# EAGLE design KSM_ICSP (EAGLE 6.4)
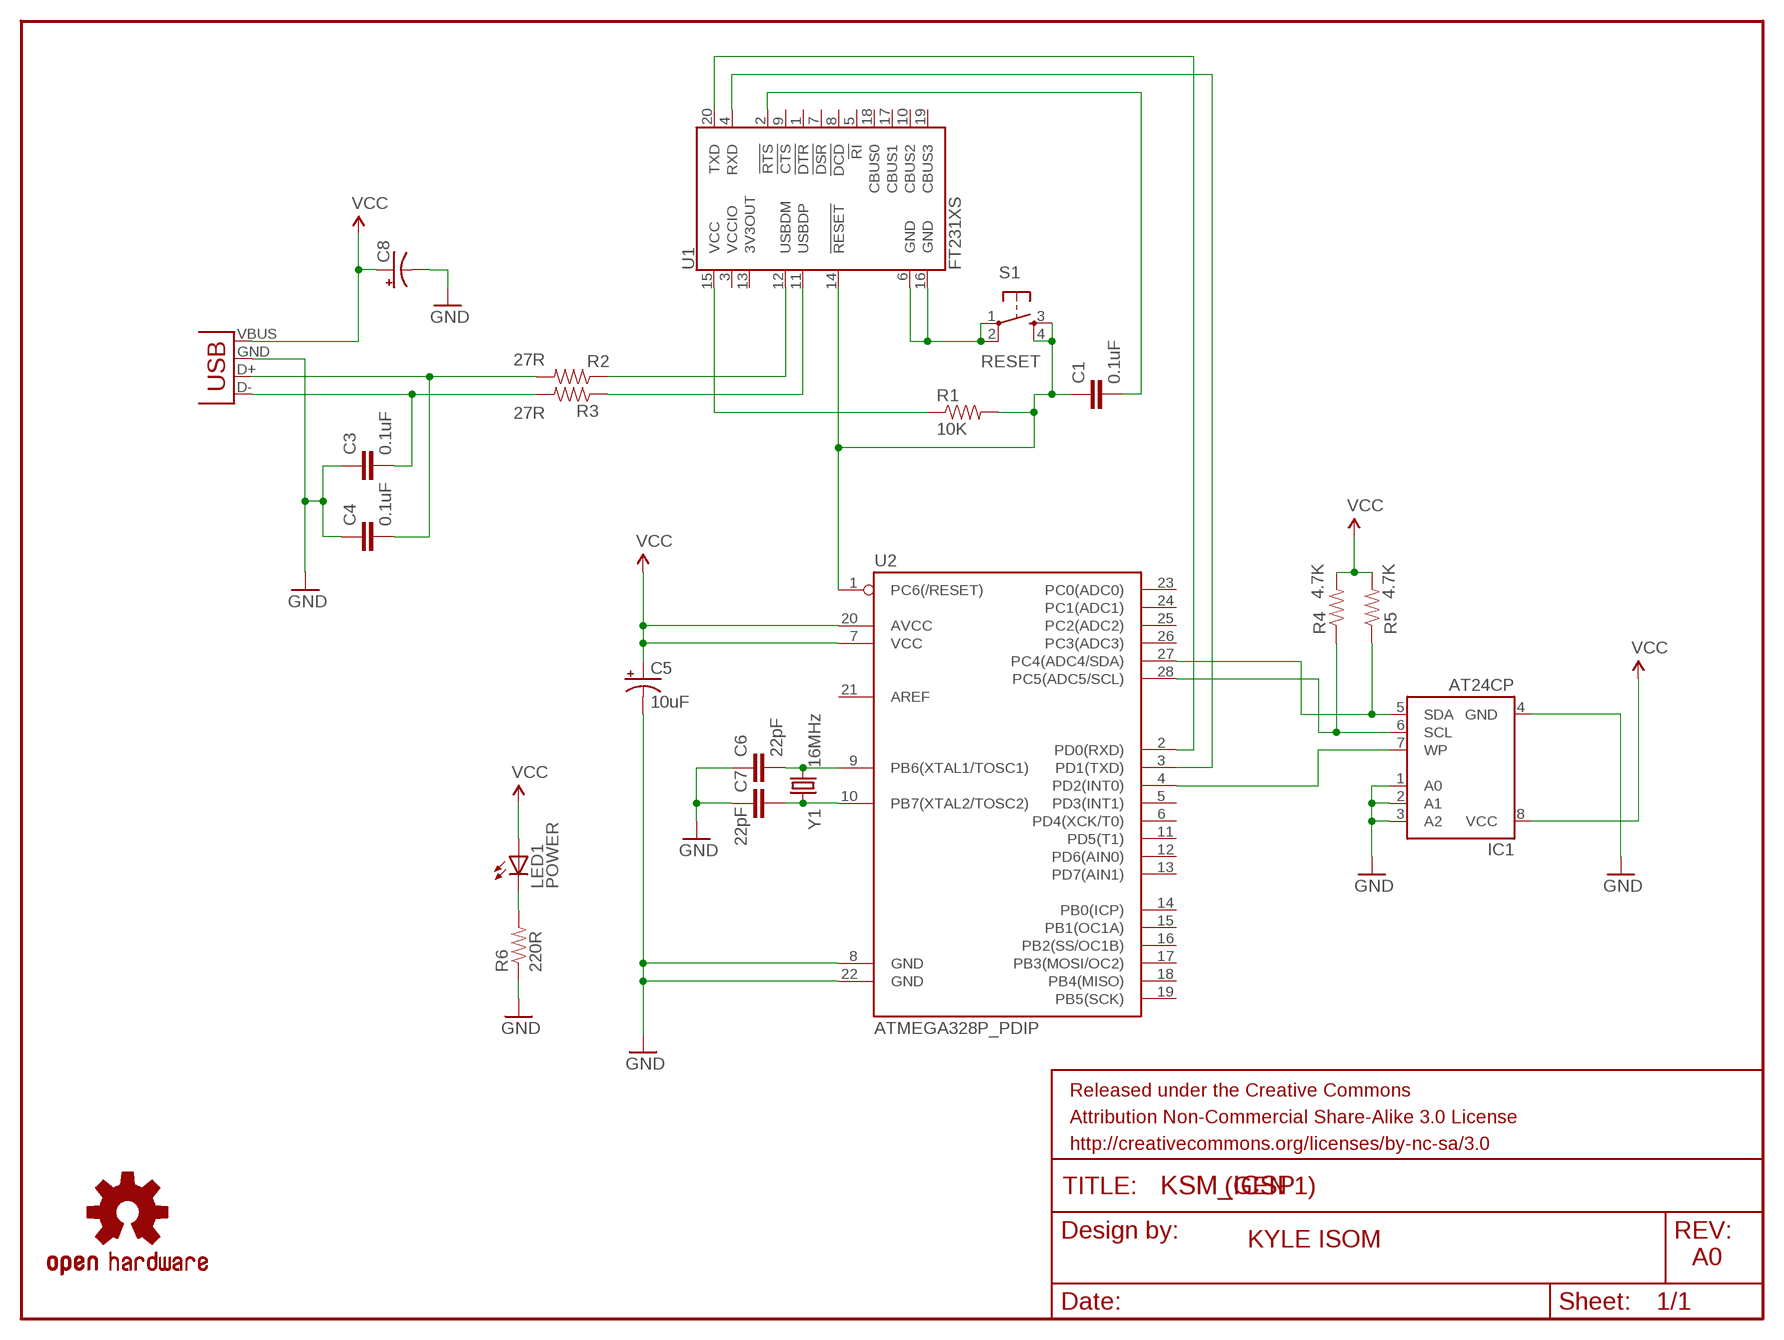
[diagram p0: schematic, sheet 1]

## Parts
C1  0.1uF  CAPPTH  [CAP-PTH-SMALL]
C3  0.1uF  CAPPTH  [CAP-PTH-SMALL]
C4  0.1uF  CAPPTH  [CAP-PTH-SMALL]
C5  10uF  CAP_POLPTH2  [CPOL-RADIAL-10UF-25V]
C6  22pF  CAPPTH  [CAP-PTH-SMALL]
C7  22pF  CAPPTH  [CAP-PTH-SMALL]
C8  CAP_POLPTH2  [CPOL-RADIAL-10UF-25V]
FRAME1  FRAME-LETTER  [CREATIVE_COMMONS]
IC1  AT24CP  [DIL08]
JP1  USB-A-H  [USB-A-H]
LED1  POWER  LED3MM  [LED3MM]
LOGO1  OSHW-LOGOL  [OSHW-LOGO-L]
R1  10K  RESISTORPTH-1/4W  [AXIAL-0.4]
R2  27R  RESISTORPTH-1/4W  [AXIAL-0.4]
R3  27R  RESISTORPTH-1/4W  [AXIAL-0.4]
R4  4.7K  RESISTORPTH-1/4W  [AXIAL-0.4]
R5  4.7K  RESISTORPTH-1/4W  [AXIAL-0.4]
R6  220R  RESISTORPTH-1/4W  [AXIAL-0.4]
S1  RESET  TAC_SWITCHPTH  [TACTILE-PTH]
U1  FT231XS  [SSOP20_L]
U2  ATMEGA328P_PDIP  [DIL28-3]
Y1  16MHz  CRYSTALHC49US  [HC49US]

## Nets
GND: C3.1 C4.1 C5.2(-) C6.1 C7.1 C8.2(-) IC1.1(A0) IC1.2(A1) IC1.3(A2) IC1.4(GND) JP1.GND(VBUS) R6.P$1 U2.8(GND) U2.22(GND)
N$1: C6.2 U2.9(PB6(XTAL1/TOSC1)) Y1.2
N$2: C7.2 U2.10(PB7(XTAL2/TOSC2)) Y1.1
N$3: IC1.7(WP) U2.4(PD2(INT0))
N$4: IC1.6(SCL) R4.P$1 U2.28(PC5(ADC5/SCL))
N$5: IC1.5(SDA) R5.P$1 U2.27(PC4(ADC4/SDA))
N$6: R3.P$1 U1.11(USBDP)
N$7: R2.P$1 U1.12(USBDM)
N$8: C4.2 JP1.D+(D-) R2.P$2
N$9: C3.2 JP1.D-(D+) R3.P$2
N$10: S1.1 S1.2 U1.6(GND) U1.16(GND)
N$11: C1.1 R1.P$2 S1.3 S1.4 U1.14(!RESET) U2.1(PC6(/RESET))
N$12: C1.2 U1.2(!RTS)
N$13: R1.P$1 U1.15(VCC)
N$14: LED1.K(C) R6.P$2
N$15: U1.20(TXD) U2.2(PD0(RXD))
N$16: U1.4(RXD) U2.3(PD1(TXD))
VCC: C5.1(+) C8.1(+) IC1.8(VCC) JP1.VBUS(GND) LED1.A R4.P$2 R5.P$2 U2.7(VCC) U2.20(AVCC)
Unconnected: U1.1(!DTR) U1.3(VCCIO) U1.5(!RI) U1.7(!DSR) U1.8(!DCD) U1.9(!CTS) U1.10(CBUS2) U1.13(3V3OUT) U1.17(CBUS1) U1.18(CBUS0) U1.19(CBUS3) U2.5(PD3(INT1)) U2.6(PD4(XCK/T0)) U2.11(PD5(T1)) U2.12(PD6(AIN0)) U2.13(PD7(AIN1)) U2.14(PB0(ICP)) U2.15(PB1(OC1A)) U2.16(PB2(SS/OC1B)) U2.17(PB3(MOSI/OC2)) U2.18(PB4(MISO)) U2.19(PB5(SCK)) U2.21(AREF) U2.23(PC0(ADC0)) U2.24(PC1(ADC1)) U2.25(PC2(ADC2)) U2.26(PC3(ADC3))

## Notes on the sheet
- (GEN 1)
- KYLE ISOM
- A0

## Library data of the parts
C1 C3 C4 C6 C7 = SparkFun-Capacitors:CAP: Capacitor Standard 0603 ceramic capacitor, and 0.1" leaded capacitor.
C5 C8 = SparkFun-Capacitors:CAP_POL: Capacitor Polarized These are standard SMD and PTH capacitors. Normally 10uF, 47uF, and 100uF in electrolytic and tantalum varieties. Always verify the external diameter of the through hole cap, it varies with capacity, voltage, and manufacturer. The EIA devices should be standard.
FRAME1 = Aesthetics:FRAME-LETTER: Schematic Frame Standard 8.5x11 US Letter frame
IC1 = EEPROM:AT24C*: 2-wire serial EEPROM; MPN: AT24C1024BW-SH-B; OC_FARNELL: 1362646; OC_NEWARK: 03P2044
JP1 = SparkFun-Connectors:USB: USB Connectors USB-B-PTH is fully proven SKU : PRT-00139/CONN-08278 USB-miniB is fully proven SKU : PRT-00587 USB-A-PCB is untested. USB-A-H is throughly reviewed, but untested. Spark Fun Electronics SKU : PRT-00437 USB-B-SMT is throughly reviewed, but untested. Needs silkscreen touching up. USB-A-S has not been used/tested USB-MB-H has not been used/tested USB-MICROB has been used. CONN-09505
LED1 = SparkFun-LED:LED: LEDs Standard schematic elements and footprints for 5mm, 3mm, 1206, and 0603 sized LEDs. 5mm - Spark Fun Electronics SKU : COM-00529 (and others)
LOGO1 = SparkFun-Aesthetics:OSHW-LOGO: Open Source Hardware Logo This logo indicates the piece of hardware it is found on incorporates a OSHW license and/or adheres to the definition of open source hardware found here: http://freedomdefined.org/OSHW
R1-R6 = SparkFun-Passives:RESISTOR: Resistor Basic schematic elements and footprints for 0603, 1206, and PTH resistors.
S1 = SparkFun-Electromechanical:TAC_SWITCH: Momentary Switch Button commonly used for reset or general input. Spark Fun Electronics SKU : COM-00097 SMT- SWCH-08247
U1 = SparkFun-DigitalIC:FT231X: FTDI FT231X Full Speed USB to Full-handshake UART This USB2.0 Full Speed IC offers a compact bridge to full handshake UART interfaces. The device is a UART, capable of operating up to 3MBaud, with low power consumption (8mA). The FT231X includes the complete FT-X series feature set and enables USB to be added into a system design quickly and easily over a UART interface.
U2 = SparkFun-DigitalIC:ATMEGA328P_PDIP: uC used in the Arduino 32kb flash, 1k EEPROM, 2k SRAM This is the through-hole version of this chip.
Y1 = SparkFun-FreqCtrl:CRYSTAL: Various standard crystals. Proven footprints. Spark Fun Electronics SKU : COM-00534

## Board
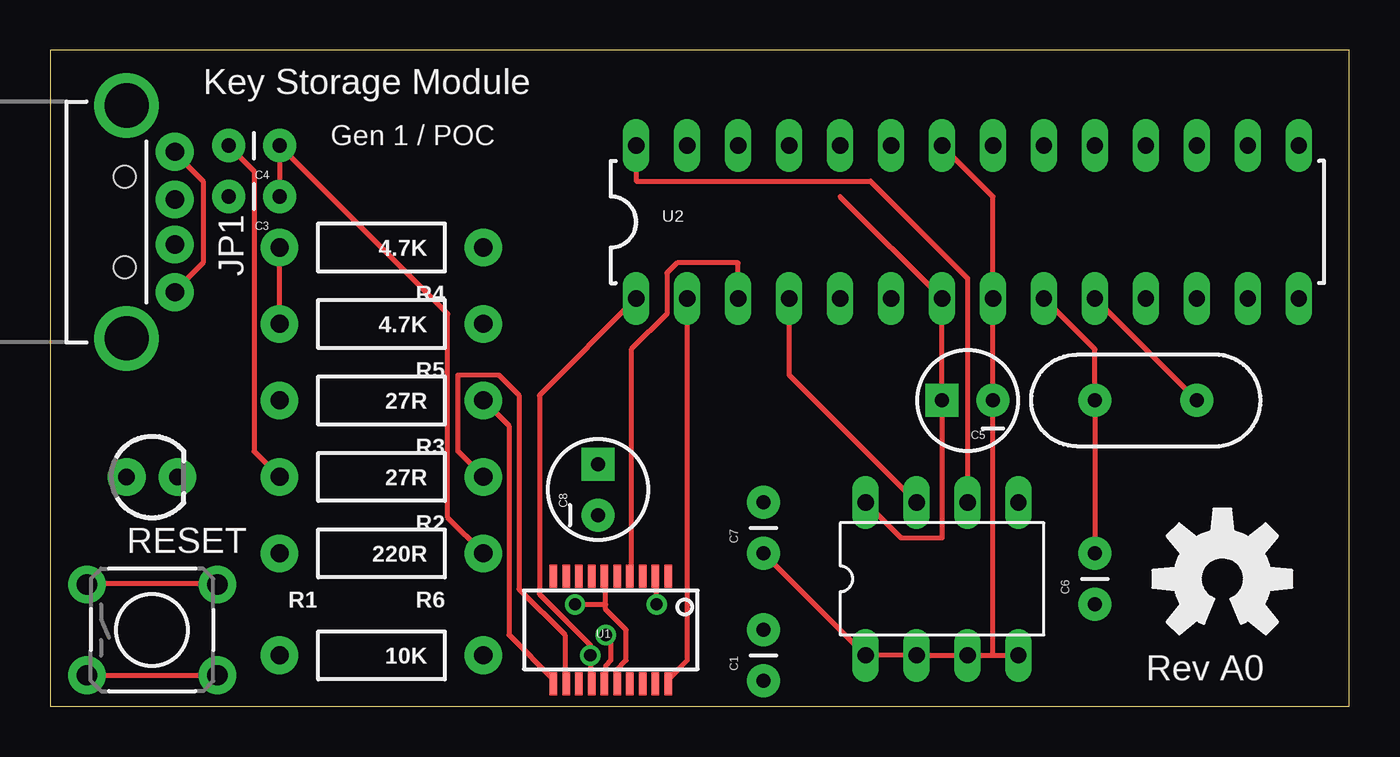
[diagram p1: board, top side]
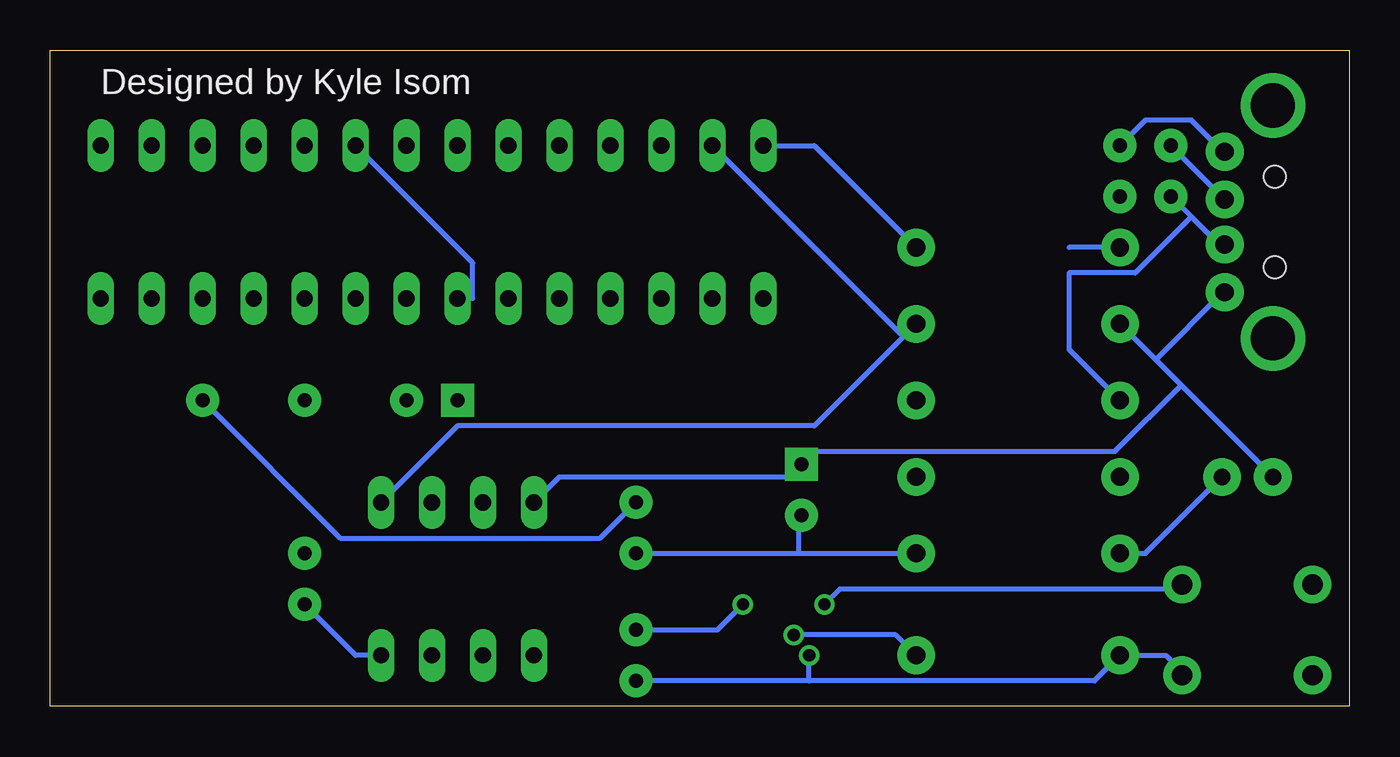
[diagram p2: board, bottom side, seen from below]

Size 64.75 x 32.69 mm. Coordinates in mm from the lower left corner, seen from the top.
Outline: 0,0 64.75,0 64.75,32.69 0,32.69 0,0
Copper layers (1*16): Top 0.035mm / dielectric 1.5mm / Bottom 0.035mm
Design rules "default": minimum track width 10mil, minimum drill 24mil, track to track 8mil, track to pad 8mil, pad to pad 8mil, via to via 8mil, smd to smd 8mil, copper to edge 40mil, drill to drill 8mil, minimum pad ring 10mil, minimum via ring 8mil, stop-mask expansion 4mil, vias tented up to drill 0mil, thermal gap 10mil

### Footprints (pad centres in the part's own frame; a part is rotated, then mirrored left to right if it is on the bottom)
CAP-PTH-SMALL = drill 0.7 pad 1.651: 1 0,0; 2 2.54,0
CPOL-RADIAL-10UF-25V = drill 0.7 pad 1.651 square: 1 1.27,0 | drill 0.7 pad 1.651: 2 -1.27,0
DIL08 = drill 0.813 long: 1 -3.81,-3.81; 2 -1.27,-3.81; 3 1.27,-3.81; 4 3.81,-3.81; 5 3.81,3.81; 6 1.27,3.81; 7 -1.27,3.81; 8 -3.81,3.81
USB-A-H = drill 0.914 pad 1.88: D+ 2.4,1.127; D- 2.4,-1.127; GND 2.4,3.5; VBUS 2.4,-3.5 | drill 2.2: GND2 0,-5.8; GND3 0,5.8 | hole 1.1: -0.1,2.25; -0.1,-2.25
LED3MM = drill 0.813 pad 1.88: A -1.27,0; K 1.27,0
AXIAL-0.4 = drill 0.9 pad 1.88: P$1 -5.08,0; P$2 5.08,0
TACTILE-PTH = drill 1.016 pad 1.88: 1 -3.251,2.261; 2 3.251,2.261; 3 -3.251,-2.261; 4 3.251,-2.261
SSOP20_L = smd 0.381 x 1.143: 1 -2.857,-2.68; 2 -2.223,-2.68; 3 -1.587,-2.68; 4 -0.953,-2.68; 5 -0.318,-2.68; 6 0.318,-2.68; 7 0.953,-2.68; 8 1.587,-2.68; 9 2.223,-2.68; 10 2.857,-2.68; 11 2.857,2.68; 12 2.223,2.68; 13 1.587,2.68; 14 0.953,2.68; 15 0.318,2.68; 16 -0.318,2.68; 17 -0.953,2.68; 18 -1.587,2.68; 19 -2.223,2.68; 20 -2.857,2.68
DIL28-3 = drill 0.813 long: 1 -16.51,-3.81; 2 -13.97,-3.81; 3 -11.43,-3.81; 4 -8.89,-3.81; 5 -6.35,-3.81; 6 -3.81,-3.81; 7 -1.27,-3.81; 8 1.27,-3.81; 9 3.81,-3.81; 10 6.35,-3.81; 11 8.89,-3.81; 12 11.43,-3.81; 13 13.97,-3.81; 14 16.51,-3.81; 15 16.51,3.81; 16 13.97,3.81; 17 11.43,3.81; 18 8.89,3.81; 19 6.35,3.81; 20 3.81,3.81; 21 1.27,3.81; 22 -1.27,3.81; 23 -3.81,3.81; 24 -6.35,3.81; 25 -8.89,3.81; 26 -11.43,3.81; 27 -13.97,3.81; 28 -16.51,3.81
HC49US = drill 0.7 pad 1.651: 1 -2.54,0; 2 2.54,0

### Placement (x,y rotation side)
C1  35.56,1.27 90 top
C3  11.43,25.4 180 top
C4  11.43,27.94 180 top
C5  45.72,15.24 180 top
C6  52.07,5.08 90 top
C7  35.56,7.62 90 top
C8  27.3,10.79 90 top
FRAME1  -10.16,-10.16 0 top  (outside the outline)
IC1  44.45,6.35 0 top
JP1  3.81,24.13 0 top
LED1  5.08,11.43 0 top
LOGO1  58.42,6.35 0 top
R1  16.51,2.54 180 top
R2  16.51,11.43 180 top
R3  16.51,15.24 180 top
R4  16.51,22.86 180 top
R5  16.51,19.05 180 top
R6  16.51,7.62 180 top
S1  5.08,3.81 0 top
U1  27.94,3.81 180 top
U2  45.72,24.13 0 top
Y1  54.61,15.24 180 top

### Tracks (layer width: path | path; a pad name or v marks a point on that pad's centre or on a via)
GND
  Top 0.254: U2.22 46.99,25.4 U2.8 C5.2 46.99,2.54 | 46.99,2.54 IC1.3 IC1.2 IC1.1 C7.1 | 46.99,2.54 IC1.4 | R6.P$1 19.81,9.4 19.81,19.56 C4.1 C3.1
  Bottom 0.254: C6.1 49.53,2.54 IC1.4 | C7.1 27.43,7.62 | 27.43,7.62 R6.P$1 | C4.1 10.16,29.21 7.87,29.21 6.35,27.69 JP1.GND | 27.43,7.62 27.43,9.4 C8.2
N$1
  Top 0.254: U2.9 52.07,17.78 Y1.2 C6.2
N$2
  Top 0.254: Y1.1 U2.10
  Bottom 0.254: C7.2 37.34,8.38 50.29,8.38 Y1.1
N$3
  Top 0.254: IC1.7 36.83,16.51 U2.4
N$4
  Top 0.254: IC1.6 45.72,21.34 40.89,26.16 29.21,26.16 U2.28
  Bottom 0.254: R4.P$1 26.67,27.94 U2.28
N$5
  Bottom 0.254: IC1.5 44.45,13.97 26.67,13.97 22.1,18.54 | U2.27 22.35,18.54 22.1,18.54 | 22.1,18.54 R5.P$1
N$6
  Top 0.254: R3.P$1 22.86,13.97 22.86,3.56 25.15,1.27 U1.11
N$7
  Top 0.254: R2.P$1 20.32,12.7 20.32,16.51 22.35,16.51 23.37,15.49 23.37,5.84 25.65,3.56 25.65,1.27 U1.12
N$8
  Top 0.254: R2.P$2 10.16,12.7 10.16,26.67 C4.2
  Bottom 0.254: C4.2 6.35,25.4 JP1.D+
N$9
  Bottom 0.254: 7.87,24.38 6.6,23.11 6.35,23.11 JP1.D- | 7.87,24.38 C3.2 | R3.P$2 13.97,17.78 13.97,21.59 10.67,21.59 7.87,24.38
N$10  (via drill 0.61)
  Top 0.254: 27.69,5.08 27.69,4.83 28.7,3.81 28.7,2.29 28.19,1.78 28.19,1.27 U1.16 | 27.69,5.08 27.69,6.35 U1.6 | v26.16,5.08 27.69,5.08 | S1.1 2.03,6.1 8.13,6.1 S1.2
  Bottom 0.254: v26.16,5.08 25.4,5.84 8.38,5.84 S1.2
N$11  (via drill 0.61)
  Top 0.254: U2.1 24.38,15.49 24.38,5.59 26.92,3.05 v26.92,2.54 26.92,1.27 U1.14 | S1.3 2.03,1.52 8.13,1.52 S1.4
  Bottom 0.254: 26.92,1.27 12.7,1.27 R1.P$2 9.14,2.54 8.38,1.78 S1.4 | 26.92,1.27 C1.1 | 26.92,1.27 v26.92,2.54
N$12  (via drill 0.61)
  Top 0.254: v30.23,5.08 30.23,6.35 U1.2
  Bottom 0.254: v30.23,5.08 31.5,3.81 C1.2
N$13  (via drill 0.61)
  Top 0.254: v27.69,3.56 27.94,3.3 27.94,2.29 27.69,2.03 27.69,1.27 U1.15
  Bottom 0.254: v27.69,3.56 22.61,3.56 R1.P$1
N$14
  Bottom 0.254: LED1.K 10.16,7.62 R6.P$2
N$15
  Top 0.254: U2.2 31.75,2.29 30.73,1.27 U1.20
N$16
  Top 0.254: U2.3 34.29,22.1 31.24,22.1 30.73,21.59 30.73,19.56 28.96,17.78 28.96,6.6 U1.4
VCC
  Top 0.254: IC1.8 42.42,8.38 44.45,8.38 C5.1 U2.7 39.37,25.4 | R5.P$2 R4.P$2 | 6.35,27.43 7.62,26.16 7.62,22.1 6.35,20.83 JP1.VBUS
  Bottom 0.254: U2.20 43.69,22.1 43.69,20.32 U2.7 | R4.P$2 13.97,22.86 | R5.P$2 9.65,17.27 | 9.65,17.27 8.38,16 | 8.38,16 LED1.A | 9.65,17.27 6.35,20.57 JP1.VBUS | IC1.8 39.37,11.43 27.94,11.43 C8.1 26.67,12.7 11.68,12.7 8.38,16

### Text on the board
tPlace: Key Storage Module | Gen 1 / POC | RESET | Rev A0
bPlace: Designed by Kyle Isom